# Altium schematic sheet boost converter.SchDoc
size A
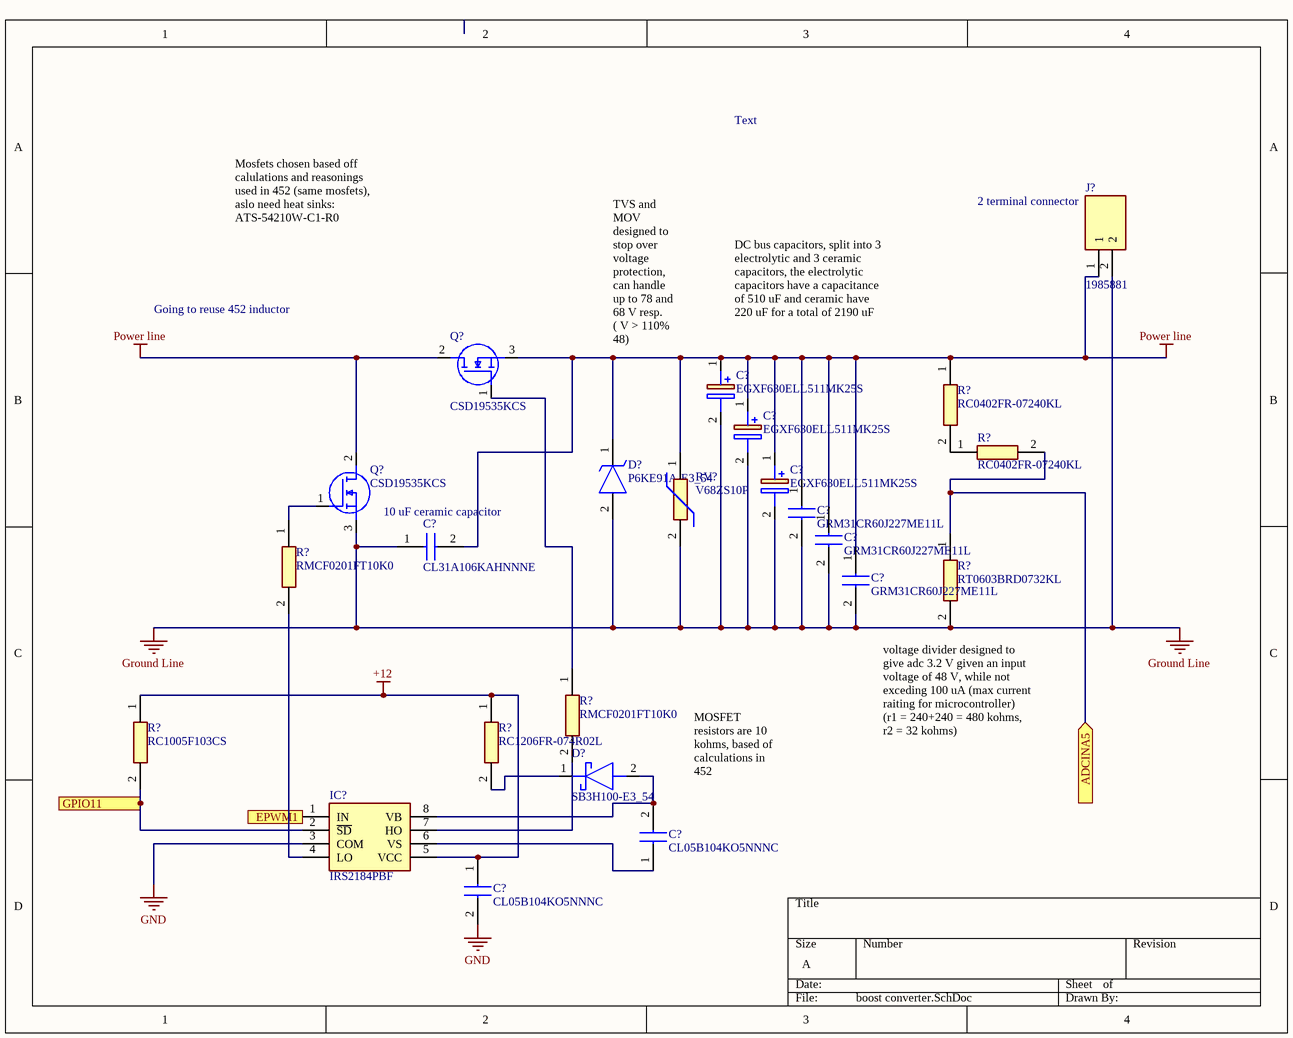
[diagram p0: boost converter.SchDoc]

## Parts
(Parts that share a designator on the sheet are numbered #1, #2 ... from top to bottom, then left to right.)
C?#1  EGXF630ELL511MK25S  [CAPPRD500W60D1275H2650]
C?#2  EGXF630ELL511MK25S  [CAPPRD500W60D1275H2650]
C?#3  EGXF630ELL511MK25S  [CAPPRD500W60D1275H2650]
C?#4  GRM31CR60J227ME11L  [CAPC3216X190N]
C?#5  GRM31CR60J227ME11L  [CAPC3216X190N]
C?#6  CL31A106KAHNNNE  [CAPC3216X180N]
C?#7  GRM31CR60J227ME11L  [CAPC3216X190N]
C?#8  CL05B104KO5NNNC  [CAPC1005X55N]
C?#9  CL05B104KO5NNNC  [CAPC1005X55N]
D?#1  P6KE91A-E3_54  [DIOAD1910W86L670D310]
D?#2  SB3H100-E3_54  [DIOAD2855W132L835D505]
IC?  IRS2184PBF  [DIP762W56P254L988H533Q8N]
J?  1985881  [1985881]
Q?#1  CSD19535KCS  [TO254P470X1016X2016-3P]
Q?#2  CSD19535KCS  [TO254P470X1016X2016-3P]
R?#1  RC0402FR-07240KL  [RESC1005X40N]
R?#2  RC0402FR-07240KL  [RESC1005X40N]
R?#3  RMCF0201FT10K0  [RESC0603X26N]
R?#4  RT0603BRD0732KL  [RESC1608X55N]
R?#5  RMCF0201FT10K0  [RESC0603X26N]
R?#6  RC1005F103CS  [RESC1005X40N]
R?#7  RC1206FR-074R02L  [RESC3116X65N]
RV?  V68ZS10P  [V68ZS10P]

## Ports
ADCINA5 (in), EPWM1 (out), GPIO11 (out)

## Nets
+12: C?#8.1 IC?.5(VCC) R?#6.1 R?#7.1
GND: C?#8.2 IC?.3(COM)
Ground Line: C?#1.2(-) C?#2.2(-) C?#3.2(-) C?#4.2 C?#5.2 C?#6.1 C?#7.2 D?#1.2(A) J?.2 Q?#2.3(S) R?#4.2 RV?.2
Power line: C?#1.1(+) C?#2.1(+) C?#3.1(+) C?#4.1 C?#5.1 C?#6.2 C?#7.1 D?#1.1(K) J?.1 Q?#1.2(D) Q?#1.3(S) Q?#2.2(D) R?#1.1 RV?.1
ADCINA5: R?#2.2 R?#4.1 ; port ADCINA5
EPWM1: IC?.1(IN) ; port EPWM1
GPIO11: IC?.2(~{SD}) R?#6.2 ; port GPIO11
NetC?#9_1: C?#9.1 IC?.6(VS)
NetC?#9_2: C?#9.2 D?#2.2(A) IC?.8(VB)
NetD?#2_1: D?#2.1(K) R?#7.2
NetIC?_4: IC?.4(LO) R?#3.2
NetIC?_7: IC?.7(HO) R?#5.2
NetQ?#1_1: Q?#1.1(G) R?#5.1
NetQ?#2_1: Q?#2.1(G) R?#3.1
NetR?#1_2: R?#1.2 R?#2.1

## Notes on the sheet
- Text
- Mosfets chosen based off calulations and reasonings used in 452 (same mosfets), aslo need heat sinks: ATS-54210W-C1-R0
- (near J?) 2 terminal connector
- Going to reuse 452 inductor
- (near C?#1) TVS and MOV designed to stop over voltage protection, can handle up to 78 and 68 V resp.
  ( V > 110% 48)
- (near C?#1) DC bus capacitors, split into 3 electrolytic and 3 ceramic capacitors, the electrolytic capacitors have a capacitance of 510 uF and ceramic have 220 uF for a total of 2190 uF
- 10 uF ceramic capacitor
- MOSFET resistors are 10 kohms, based of calculations in 452
- voltage divider designed to give adc 3.2 V given an input voltage of 48 V, while not exceding 100 uA (max current raiting for microcontroller) (r1 = 240+240 = 480 kohms, r2 = 32 kohms)

## Library data of the parts
C?#1-C?#3 = EGXF630ELL511MK25S: Capacitor Polarised; Manufacturer_Name: United Chemi-Con; Datasheet Link: https://www.mouser.com/datasheet/2/420/United-Chemi-Con-1016798.pdf; Height: 26.5mm; Manufacturer_Part_Number: EGXF630ELL511MK25S; Mouser Part Number: 661-EGXF630ELL511MK2; Mouser Price/Stock: https://www.mouser.co.uk/ProductDetail/United-Chemi-Con/EGXF630ELL511MK25S?qs=8BXZADTIn4FuMrtucNpwhg%3D%3D
C?#4 C?#5 C?#7 = GRM31CR60J227ME11L: Capacitor; Manufacturer_Name: Murata Electronics; Datasheet Link: https://www.murata.com/products/productdetail?partno=GRM31CR60J227ME11%23; Height: 1.9mm; Manufacturer_Part_Number: GRM31CR60J227ME11L; Mouser Part Number: 81-GRM31CR60J227ME1L; Mouser Price/Stock: https://www.mouser.co.uk/ProductDetail/Murata-Electronics/GRM31CR60J227ME11L?qs=qSv5qXjCIG0eiOVJsXqfJw%3D%3D; Arrow Part Number: GRM31CR60J227ME11L; Arrow Price/Stock: https://www.arrow.com/en/products/grm31cr60j227me11l/murata-manufacturing?region=nac
C?#6 = CL31A106KAHNNNE: Capacitor; Manufacturer_Name: Samsung Electro-Mechanics; Datasheet Link: https://datasheet.datasheetarchive.com/originals/distributors/Datasheets_SAMA/8c86add0e95aa125c91e23e767429ce6.pdf; Height: 1.8mm; Manufacturer_Part_Number: CL31A106KAHNNNE; Mouser Part Number: 187-CL31A106KAHNNNE; Mouser Price/Stock: https://www.mouser.co.uk/ProductDetail/Samsung-Electro-Mechanics/CL31A106KAHNNNE?qs=349EhDEZ59rSHw4%2FqTnHBg%3D%3D; Arrow Part Number: CL31A106KAHNNNE; Arrow Price/Stock: https://www.arrow.com/en/products/cl31a106kahnnne/samsung-electro-mechanics?region=europe
C?#8 C?#9 = CL05B104KO5NNNC: Capacitor; Manufacturer_Name: Samsung Electro-Mechanics; Datasheet Link: https://datasheet.datasheetarchive.com/originals/distributors/Datasheets-DGA10/2408147.pdf; Height: 0.55mm; Manufacturer_Part_Number: CL05B104KO5NNNC; Mouser Part Number: 187-CL05B104KO5NNNC; Mouser Price/Stock: https://www.mouser.co.uk/ProductDetail/Samsung-Electro-Mechanics/CL05B104KO5NNNC?qs=hqM3L16%252BxlfT2SKOuAUq6Q%3D%3D; Arrow Part Number: CL05B104KO5NNNC; Arrow Price/Stock: https://www.arrow.com/en/products/cl05b104ko5nnnc/samsung-electro-mechanics?region=europe
D?#1 = P6KE91A-E3_54: TVS Diode (Uni-directional); Manufacturer_Name: Vishay; Manufacturer_Part_Number: P6KE91A-E3/54; Datasheet Link: https://www.mouser.com/datasheet/2/427/p6ke-1767850.pdf
D?#2 = SB3H100-E3_54: Schottky Diode; Manufacturer_Name: Vishay; Manufacturer_Part_Number: SB3H100-E3/54; Datasheet Link: http://www.vishay.com/docs/88720/sb3h90.pdf; Mouser Part Number: 625-SB3H100-E3; Mouser Price/Stock: https://www.mouser.co.uk/ProductDetail/Vishay-General-Semiconductor/SB3H100-E3-54?qs=u91jd7aysvP%252BosR3IQl24Q%3D%3D
IC? = IRS2184PBF: Integrated Circuit; Manufacturer_Name: Infineon; Datasheet Link: http://uk.rs-online.com/web/p/products/0456214; Height: 5.33mm; Manufacturer_Part_Number: IRS2184PBF; Mouser Part Number: 942-IRS2184PBF; Mouser Price/Stock: https://www.mouser.co.uk/ProductDetail/Infineon-Technologies/IRS2184PBF?qs=9%252BKlkBgLFf3%2F4k8XP8%252BWIw%3D%3D; Arrow Part Number: IRS2184PBF; Arrow Price/Stock: https://www.arrow.com/en/products/irs2184pbf/infineon-technologies-ag?region=nac
J? = 1985881: Connector; Manufacturer_Name: Phoenix Contact; Datasheet Link: https://www.digikey.com/en/products/detail/phoenix-contact/1985881/2511015; Height: 13.9mm; Manufacturer_Part_Number: 1985881; Mouser Part Number: 651-1985881; Mouser Price/Stock: https://www.mouser.co.uk/ProductDetail/Phoenix-Contact/1985881?qs=YbgdthCBnKfqOEwK0VcNyQ%3D%3D; Arrow Part Number: 1985881; Arrow Price/Stock: https://www.arrow.com/en/products/1985881/phoenix-contact?region=nac
Q?#1 Q?#2 = CSD19535KCS: MOSFET (N-Channel); Manufacturer_Name: Texas Instruments; Datasheet Link: http://www.ti.com/lit/gpn/csd19535kcs; Height: 4.7mm; Manufacturer_Part_Number: CSD19535KCS; Mouser Part Number: 595-CSD19535KCS; Mouser Price/Stock: https://www.mouser.co.uk/ProductDetail/Texas-Instruments/CSD19535KCS?qs=%252BFzhjShcsaKxX2b6%252BzyX%2Fw%3D%3D; Arrow Part Number: CSD19535KCS; Arrow Price/Stock: https://www.arrow.com/en/products/csd19535kcs/texas-instruments?region=nac
R?#1 R?#2 = RC0402FR-07240KL: Resistor; Manufacturer_Name: YAGEO (PHYCOMP); Datasheet Link: https://datasheet.datasheetarchive.com/originals/distributors/Datasheets_SAMA/902f9e387b938f871d31120f5fc1d65e.pdf; Height: 0.4mm; Manufacturer_Part_Number: RC0402FR-07240KL; Mouser Part Number: 603-RC0402FR-07240KL; Mouser Price/Stock: https://www.mouser.co.uk/ProductDetail/YAGEO/RC0402FR-07240KL?qs=UOUeRUa%252B8Wk%2FVV3xbpEz8g%3D%3D; Arrow Part Number: RC0402FR-07240KL; Arrow Price/Stock: https://www.arrow.com/en/products/rc0402fr-07240kl/yageo
R?#3 R?#5 = RMCF0201FT10K0: Resistor; Manufacturer_Name: Stackpole Electronics Inc.; Datasheet Link: https://www.seielect.com/catalog/sei-rmcf_rmcp.pdf; Height: 0.26mm; Manufacturer_Part_Number: RMCF0201FT10K0; Arrow Part Number: RMCF0201FT10K0; Arrow Price/Stock: https://www.arrow.com/en/products/rmcf0201ft10k0/stackpole-electronics?region=nac
R?#4 = RT0603BRD0732KL: Resistor; Manufacturer_Name: YAGEO (PHYCOMP); Datasheet Link: https://www.mouser.com/datasheet/2/447/PYu-RT_1-to-0.01_RoHS_L_9-1222720.pdf; Height: 0.55mm; Manufacturer_Part_Number: RT0603BRD0732KL; Mouser Part Number: 603-RT0603BRD0732KL; Mouser Price/Stock: https://www.mouser.co.uk/ProductDetail/Yageo/RT0603BRD0732KL/?qs=bQfrgN9vNvx59w0%252BvAxCSQ%3D%3D
R?#6 = RC1005F103CS: Resistor; Manufacturer_Name: Samsung Electro-Mechanics; Datasheet Link: https://datasheet.datasheetarchive.com/originals/distributors/Datasheets-DGA22/1466507.pdf; Height: 0.4mm; Manufacturer_Part_Number: RC1005F103CS; Mouser Part Number: N/A; Mouser Price/Stock: https://www.mouser.com/Search/Refine.aspx?Keyword=N%2FA; Arrow Part Number: RC1005F103CS; Arrow Price/Stock: https://www.arrow.com/en/products/rc1005f103cs/samsung-electro-mechanics
R?#7 = RC1206FR-074R02L: Resistor; Manufacturer_Name: YAGEO (PHYCOMP); Datasheet Link: https://datasheet.datasheetarchive.com/originals/distributors/Datasheets_SAMA/902f9e387b938f871d31120f5fc1d65e.pdf; Height: 0.65mm; Manufacturer_Part_Number: RC1206FR-074R02L; Arrow Part Number: RC1206FR-074R02L; Arrow Price/Stock: https://www.arrow.com/en/products/rc1206fr-074r02l/yageo
RV? = V68ZS10P: Varistor; Manufacturer_Name: LITTELFUSE; Datasheet Link: http://www.littelfuse.com/~/media/electronics/datasheets/varistors/littelfuse_varistor_za_datasheet.pdf.pdf; Height: 20mm; Manufacturer_Part_Number: V68ZS10P; Mouser Part Number: 576-V68ZS10P; Mouser Price/Stock: https://www.mouser.co.uk/ProductDetail/Littelfuse/V68ZS10P?qs=1%2FWRN91BpNvIRlTsONWDiQ%3D%3D